# EAGLE design controller4 (EAGLE 9.6.2)
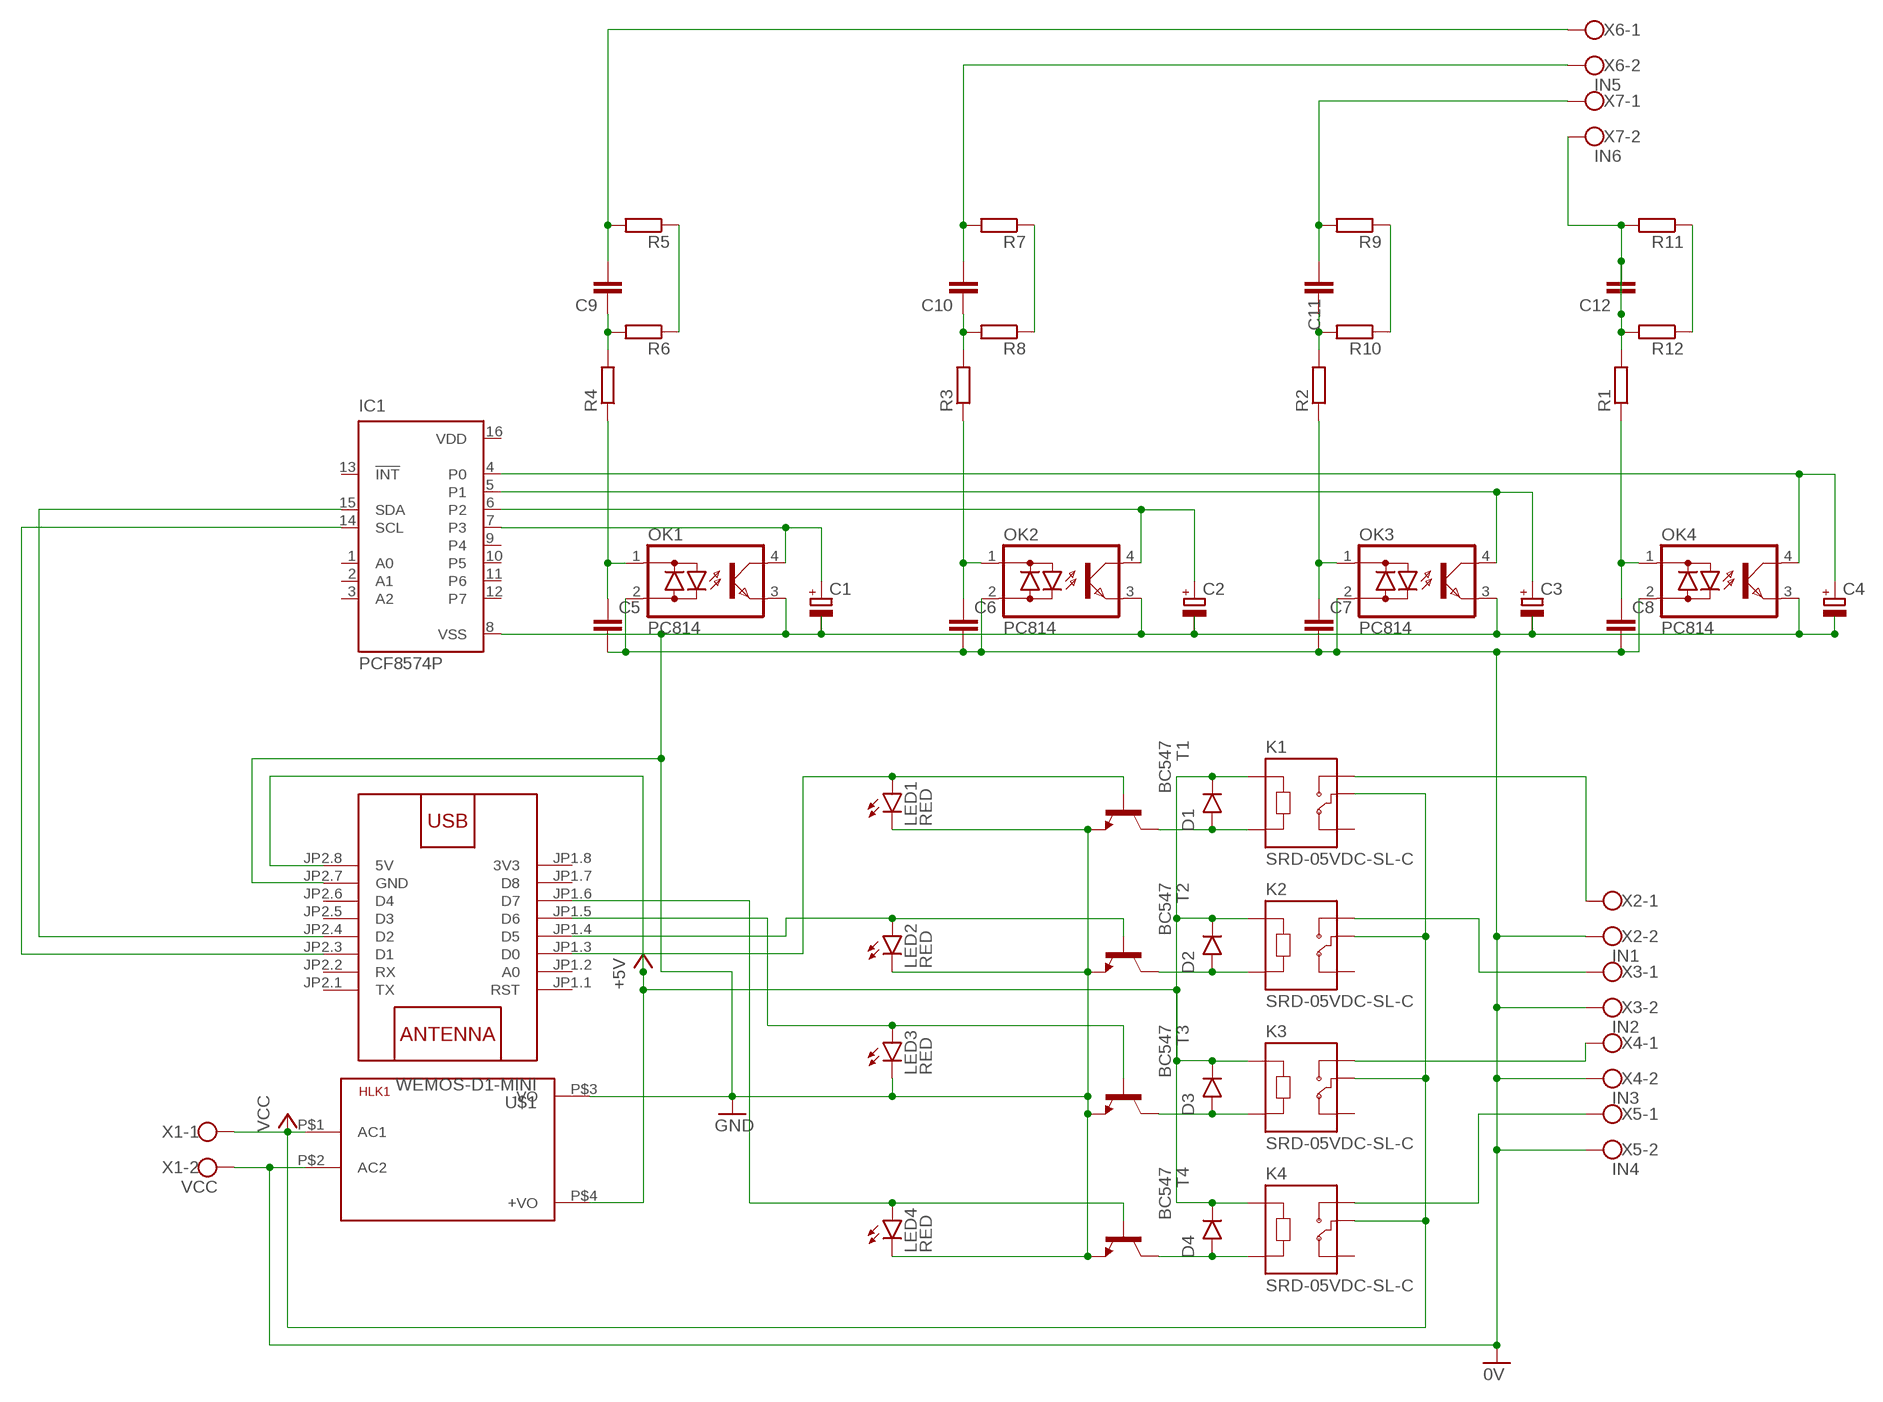
[diagram p0: schematic, sheet 1]

## Parts
C1  CPOL-EUE5-5  [E5-5]
C2  CPOL-EUE5-5  [E5-5]
C3  CPOL-EUE5-5  [E5-5]
C4  CPOL-EUE5-5  [E5-5]
C5  C-EU025-024X044  [C025-024X044]
C6  C-EU025-024X044  [C025-024X044]
C7  C-EU025-024X044  [C025-024X044]
C8  C-EU025-024X044  [C025-024X044]
C9  C-EU025-024X044  [C025-024X044]
C10  C-EU025-024X044  [C025-024X044]
C11  C-EU025-024X044  [C025-024X044]
C12  C-EU025-024X044  [C025-024X044]
D1  1N4001  [DO41-10]
D2  1N4001  [DO41-10]
D3  1N4001  [DO41-10]
D4  1N4001  [DO41-10]
HLK1  HLK-PM013W  [HLK-PM01]
IC1  PCF8574P  [DIL16]
K1  SRD-05VDC-SL-C  [RELAY_SRD-05VDC-SL-C]
K2  SRD-05VDC-SL-C  [RELAY_SRD-05VDC-SL-C]
K3  SRD-05VDC-SL-C  [RELAY_SRD-05VDC-SL-C]
K4  SRD-05VDC-SL-C  [RELAY_SRD-05VDC-SL-C]
LED1  RED  LED3MM  [LED3MM]
LED2  RED  LED3MM  [LED3MM]
LED3  RED  LED3MM  [LED3MM]
LED4  RED  LED3MM  [LED3MM]
OK1  PC814  [DIL04]
OK2  PC814  [DIL04]
OK3  PC814  [DIL04]
OK4  PC814  [DIL04]
R1  R-EU_0204/5  [0204/5]
R2  R-EU_0204/5  [0204/5]
R3  R-EU_0204/5  [0204/5]
R4  R-EU_0204/5  [0204/5]
R5  R-EU_0204/5  [0204/5]
R6  R-EU_0204/5  [0204/5]
R7  R-EU_0204/5  [0204/5]
R8  R-EU_0204/5  [0204/5]
R9  R-EU_0204/5  [0204/5]
R10  R-EU_0204/5  [0204/5]
R11  R-EU_0204/5  [0204/5]
R12  R-EU_0204/5  [0204/5]
T1  BC547  [TO92]
T2  BC547  [TO92]
T3  BC547  [TO92]
T4  BC547  [TO92]
U$1  WEMOS-D1-MINI  [WEMOS-D1-MINI]
X1  VCC  W237-102  [W237-102]
X2  IN1  W237-102  [W237-102]
X3  IN2  W237-102  [W237-102]
X4  IN3  W237-102  [W237-102]
X5  IN4  W237-102  [W237-102]
X6  IN5  W237-102  [W237-102]
X7  IN6  W237-102  [W237-102]

## Nets
0V: C5.2 C6.2 C7.2 C8.2 HLK1.P$2(AC2) OK1.2(AC2) OK2.2(AC2) OK3.2(AC2) OK4.2(AC2) X1.2 X2.2 X3.2 X4.2 X5.2
+5V: D1.C(CATHODE) D2.C(CATHODE) D3.C(CATHODE) D4.C(CATHODE) HLK1.P$4(+VO) K1.A1 K2.A1 K3.A1 K4.A1 U$1.JP2.8(5V)
GND: C1.- C2.- C3.- C4.- HLK1.P$3(-VO) IC1.8(VSS) LED1.K(C) LED2.K(C) LED3.K(C) LED4.K(C) OK1.3(E) OK2.3(E) OK3.3(E) OK4.3(E) T1.1(E) T2.1(E) T3.1(E) T4.1(E) U$1.JP2.7(GND)
N$1: D1.A(ANODE) K1.A2 T1.3(C)
N$2: K1.NO X2.1
N$3: D2.A(ANODE) K2.A2 T2.3(C)
N$4: D3.A(ANODE) K3.A2 T3.3(C)
N$5: D4.A(ANODE) K4.A2 T4.3(C)
N$6: C1.+ IC1.7(P3) OK1.4(C)
N$7: C2.+ IC1.6(P2) OK2.4(C)
N$8: C3.+ IC1.5(P1) OK3.4(C)
N$9: C4.+ IC1.4(P0) OK4.4(C)
N$10: C9.1 R4.2 R6.2
N$11: K2.NO X3.1
N$12: K3.NO X4.1
N$13: K4.NO X5.1
N$14: LED2.A T2.2(B) U$1.JP1.4(D5)
N$15: LED1.A T1.2(B) U$1.JP1.3(D0)
N$16: LED4.A T4.2(B) U$1.JP1.6(D7)
N$17: IC1.14(SCL) U$1.JP2.3(D1)
N$18: IC1.15(SDA) U$1.JP2.4(D2)
N$19: LED3.A T3.2(B) U$1.JP1.5(D6)
N$20: C10.1 R3.2 R8.2
N$21: C11.1 R2.2 R10.2
N$22: C8.1 OK4.1(AC1) R1.1
N$23: C11.2 R9.2 X7.1
N$24: C10.2 R7.2 X6.2
N$25: C9.2 R5.2 X6.1
N$26: R5.1 R6.1
N$27: C12.1 C12.2 R1.2 R11.2 R12.2 X7.2
N$28: C7.1 OK3.1(AC1) R2.1
N$29: C6.1 OK2.1(AC1) R3.1
N$30: C5.1 OK1.1(AC1) R4.1
N$31: R7.1 R8.1
N$32: R9.1 R10.1
N$33: R11.1 R12.1
VCC: HLK1.P$1(AC1) K1.COM K2.COM K3.COM K4.COM X1.1
Unconnected: IC1.1(A0) IC1.2(A1) IC1.3(A2) IC1.9(P4) IC1.10(P5) IC1.11(P6) IC1.12(P7) IC1.13(!INT) K1.NC K2.NC K3.NC K4.NC U$1.JP1.1(RST) U$1.JP1.2(A0) U$1.JP1.7(D8) U$1.JP2.1(TX) U$1.JP2.2(RX) U$1.JP2.5(D3) U$1.JP2.6(D4)

## Power pins joined to a net without a drawn wire
3V3: U$1.JP1.8(3V3)
VDD: IC1.16(VDD)

## Library data of the parts
C1-C4 = rcl:CPOL-EU: POLARIZED CAPACITOR, European symbol; SPICEPREFIX: C
C5-C12 = rcl:C-EU: CAPACITOR, European symbol; SPICEPREFIX: C
D1-D4 = tango:1N4001: DIODE general purpose rectifier, 1 A
HLK1 = HLK-PM01:HLK-PM01: Hi-Link Power Supply HLK-PM01 3W Author: Ahmed Said <https://github.com/AhmedSaid/EAGLELibraries>
IC1 = micro-philips:PCF8574: I2C-Bus Remote 8-bit I/O expander http://www.semiconductors.philips.com/acrobat_download/datasheets/PCF8574_4.pdf; MPN: PCF8574PN; OC_FARNELL: 204020; OC_NEWARK: 11N8515
K1-K4 = SRD-05VDC-SL-C (1):SRD-05VDC-SL-C: 5V Trigger Relay Module For Arduino And Raspberry Pi 5V Trigger Relay Module For Arduino And Raspberry Pi; AVAILABILITY: Unavailable; DESCRIPTION: 5V Trigger Relay Module For Arduino And Raspberry Pi 5V Trigger Relay Module For Arduino And Raspberry Pi; MF: Songle Relay; MP: SRD-05VDC-SL-C; PACKAGE: None; PRICE: None
LED1-LED4 = led:LED: LED OSRAM: - CHIPLED LG R971, LG N971, LY N971, LG Q971, LY Q971, LO R971, LY R971 LH N974, LH R974 LS Q976, LO Q976, LY Q976 LO Q996 - Hyper CHIPLED LW Q18S LB Q993, LB Q99A, LB R99A - SideLED LS A670, LO A670, LY A670, LG A670, LP A670 LB A673, LV A673, LT A673, LW A673 LH A674 LY A675 LS A676, LA A676, LO A676, LY A676, LW A676 LS A679, LY A679, LG A679 - Hyper Micro SIDELED® LS Y876, LA Y876, LO Y876, LY Y876 LT Y87S - SmartLED LW L88C, LW L88S LB L89C, LB L89S, LG L890 LS L89K, LO L89K, LY L89K LS L896, LA L896, LO L896, LY L896 - TOPLED LS T670, LO T670, LY T670, LG T670, LP T670 LSG T670, LSP T670, LSY T670, LOP T670, LYG T670 LG T671, LOG T671, LSG T671 LB T673, LV T673, LT T673, LW T673 LH T674 LS T676, LA T676, LO T676, LY T676, LB T676, LH T676, LSB T676, LW T676 LB T67C, LV T67C, LT T67C, LS T67K, LO T67K, LY T67K, LW E67C LS E67B, LA E67B, LO E67B, LY E67B, LB E67C, LV E67C, LT E67C LW T67C LS T679, LY T679, LG T679 LS T770, LO T770, LY T770, LG T770, LP T770 LB T773, LV T773, LT T773, LW T773 LH T774 LS E675, LA E675, LY E675, LS T675 LS T776, LA T776, LO T776, LY T776, LB T776 LHGB T686 LT T68C, LB T68C - Hyper Mini TOPLED® LB M676 - Mini TOPLED Santana® LG M470 LS M47K, LO M47K, LY M47K Source: http://www.osram.convergy.de LUXEON: - LUMILED® LXK2-PW12-R00, LXK2-PW12-S00, LXK2-PW14-U00, LXK2-PW14-V00 LXK2-PM12-R00, LXK2-PM12-S00, LXK2-PM14-U00 LXK2-PE12-Q00, LXK2-PE12-R00, LXK2-PE12-S00, LXK2-PE14-T00, LXK2-PE14-U00 LXK2-PB12-K00, LXK2-PB12-L00, LXK2-PB12-M00, LXK2-PB14-N00, LXK2-PB14-P00, LXK2-PB14-Q00 LXK2-PR12-L00, LXK2-PR12-M00, LXK2-PR14-Q00, LXK2-PR14-R00 LXK2-PD12-Q00, LXK2-PD12-R00, LXK2-PD12-S00 LXK2-PH12-R00, LXK2-PH12-S00 LXK2-PL12-P00, LXK2-PL12-Q00, LXK2-PL12-R00 Source: www.luxeon.com KINGBRIGHT: KA-3528ASYC Source: www.kingbright.com
OK1-OK4 = optocoupler:PC814: SHARP OPTO COUPLER; OC_FARNELL: 9707662; OC_NEWARK: unknown
R1-R12 = rcl:R-EU_: RESISTOR, European symbol; SPICEPREFIX: R
T1-T4 = transistor:BC547: NPN TRANSISTOR
U$1 = diy-modules:WEMOS-D1-MINI: WEMOS D1 mini: Mini Wi-Fi Board based on ESP-8266 device More details can be found here: https://www.wemos.cc/product/d1-mini.html Click here to find device on ebay.com <http://www.ebay.com/sch/wemos+d1+mini+nodemcu>
X1-X7 = con-wago-500:W237-102: WAGO SCREW CLAMP; MPN: 237-102; OC_FARNELL: unknown; OC_NEWARK: 70K9898

## Board
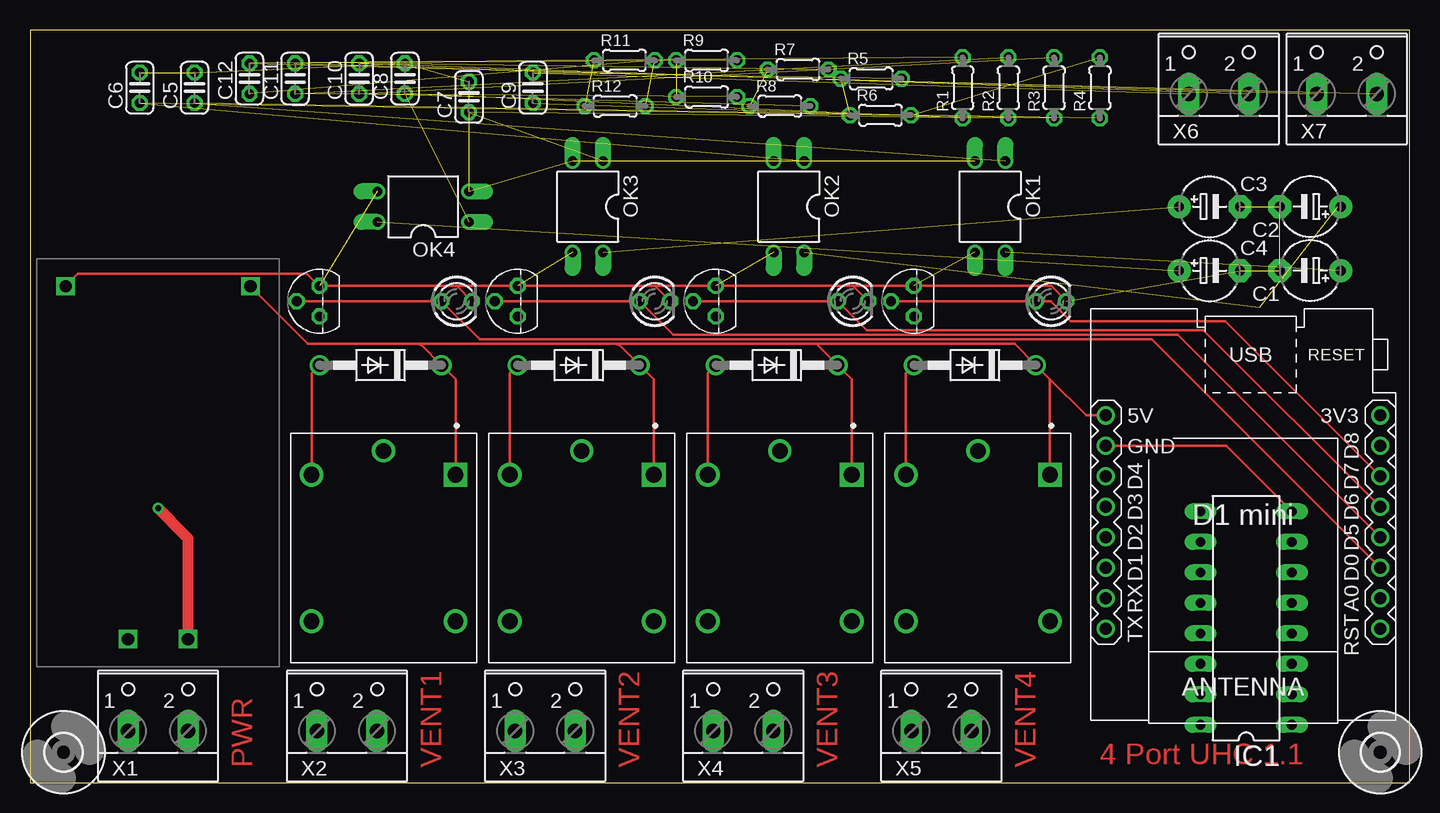
[diagram p1: board, top side]
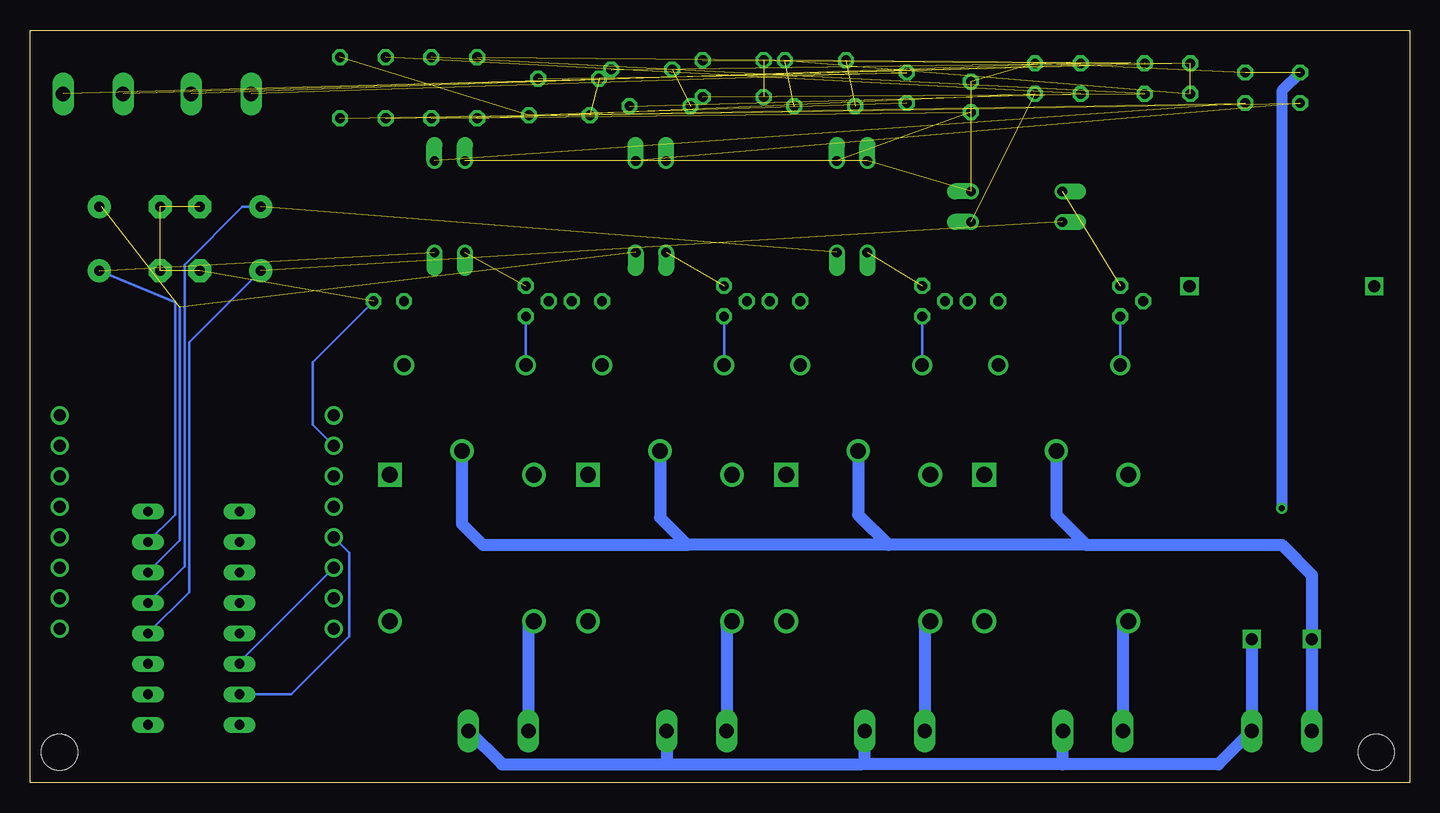
[diagram p2: board, bottom side, seen from below]

Size 114.99 x 62.73 mm. Coordinates in mm from the lower left corner, seen from the top.
Outline: 0,0 114.99,0 114.99,62.73 0,62.73 0,0
Copper layers (1*16): Top 0.035mm / dielectric 1.5mm / Bottom 0.035mm
Design rules "default": minimum track width 6mil, minimum drill 0.35mm, track to track 6mil, track to pad 6mil, pad to pad 6mil, via to via 6mil, smd to smd 6mil, copper to edge 40mil, drill to drill 6mil, minimum pad ring 10mil, minimum via ring 8mil, stop-mask expansion 4mil, vias tented up to drill 0mil, thermal gap 10mil

### Footprints (pad centres in the part's own frame; a part is rotated, then mirrored left to right if it is on the bottom)
E5-5 = drill 0.813 pad 1.905: + -2.54,0 | drill 0.813 pad 1.905 octagon: - 2.54,0
C025-024X044 = drill 0.813 octagon: 1 -1.27,0; 2 1.27,0
DO41-10 = drill 1.118: A 5.08,0; C -5.08,0
HLK-PM01 = drill 1.016 square: P$1 -14.7,2.5; P$2 -14.7,-2.5; P$3 14.7,7.7; P$4 14.7,-7.7
DIL16 = drill 0.813 long: 1 -8.89,-3.81; 2 -6.35,-3.81; 3 -3.81,-3.81; 4 -1.27,-3.81; 5 1.27,-3.81; 6 3.81,-3.81; 7 6.35,-3.81; 8 8.89,-3.81; 9 8.89,3.81; 10 6.35,3.81; 11 3.81,3.81; 12 1.27,3.81; 13 -1.27,3.81; 14 -3.81,3.81; 15 -6.35,3.81; 16 -8.89,3.81
RELAY_SRD-05VDC-SL-C = drill 1.32 square: A1 -6.1,6 | drill 1.32: A2 -6.1,-6; NC 6.1,6; NO 6.1,-6 | drill 1.29: COM -8.1,0
LED3MM = drill 0.813 octagon: A -1.27,0; K 1.27,0
DIL04 = drill 0.813 offset: 1 -1.27,-3.81; 2 1.27,-3.81; 3 1.27,3.81; 4 -1.27,3.81
0204/5 = drill 0.813 octagon: 1 -2.54,0; 2 2.54,0
TO92 = drill 0.813 octagon: 1 1.27,0; 2 0,1.905; 3 -1.27,0
WEMOS-D1-MINI = drill 1: JP1.1 -11.43,9.525; JP1.2 -11.43,6.985; JP1.3 -11.43,4.445; JP1.4 -11.43,1.905; JP1.5 -11.43,-0.635; JP1.6 -11.43,-3.175; JP1.7 -11.43,-5.715; JP1.8 -11.43,-8.255; JP2.1 11.43,9.525; JP2.2 11.43,6.985; JP2.3 11.43,4.445; JP2.4 11.43,1.905; JP2.5 11.43,-0.635; JP2.6 11.43,-3.175; JP2.7 11.43,-5.715; JP2.8 11.43,-8.255
3,0 = hole 3: 0,0
W237-102 = drill 1.194 long: 1 -2.5,-1.27; 2 2.5,-1.27

### Placement (x,y rotation side)
C1  106.68,42.67 180 top
C2  106.68,48.01 180 top
C3  98.3,48.01 0 top
C4  98.3,42.67 0 top
C5  13.72,57.91 90 top
C6  9.14,57.91 90 top
C7  36.58,57.15 90 top
C8  31.24,58.67 90 top
C9  41.91,57.91 90 top
C10  27.43,58.67 90 top
C11  22.1,58.67 90 top
C12  18.29,58.67 90 top
D1  29.21,34.8 180 top
D2  45.72,34.8 180 top
D3  62.23,34.8 180 top
D4  78.74,34.8 180 top
HLK1  10.67,26.67 90 top
IC1  101.35,13.72 90 top
K1  29.46,19.56 270 top
K2  45.97,19.56 270 top
K3  62.48,19.56 270 top
K4  78.99,19.56 270 top
LED1  35.56,40.13 0 top
LED2  52.07,40.13 0 top
LED3  68.58,40.13 0 top
LED4  85.09,40.13 0 top
OK1  80.01,48.01 180 top
OK2  63.25,48.01 180 top
OK3  46.48,48.01 180 top
OK4  32.77,48.01 90 top
R1  77.72,57.91 90 top
R2  81.53,57.91 90 top
R3  85.34,57.91 90 top
R4  89.15,57.91 90 top
R5  70.1,58.67 0 top
R6  70.87,55.63 0 top
R7  64.01,59.44 0 top
R8  62.48,56.39 0 top
R9  56.39,60.2 0 top
R10  56.39,57.15 0 top
R11  49.53,60.2 0 top
R12  48.77,56.39 0 top
T1  24.13,40.13 90 top
T2  40.64,40.13 90 top
T3  57.15,40.13 90 top
T4  73.66,40.13 90 top
U$1  101.09,22.35 180 top
U$2  [3,0]  112.52,2.54 0 top
U$3  [3,0]  2.79,2.54 0 top
X1  10.67,5.59 0 top
X2  26.42,5.59 0 top
X3  42.93,5.59 0 top
X4  59.44,5.59 0 top
X5  75.95,5.59 0 top
X6  99.06,58.67 0 top
X7  109.73,58.67 0 top

### Tracks (layer width: path | path; a pad name or v marks a point on that pad's centre or on a via)
0V  (via drill 0.5)  (7 unrouted)
  Top 0.914: HLK1.P$2 13.17,20.35 12.95,20.57 v10.67,22.86
  Bottom 0.914: C6.2 10.67,57.66 v10.67,22.86
  Bottom 1.016: HLK1.P$2 X1.2 15.96,1.52 28.96,1.52 | X5.2 75.65,1.52 61.72,1.52 | 28.96,1.52 45.72,1.52 | 61.72,1.52 45.72,1.52 | 28.96,1.52 28.92,1.56 X2.2 | 45.72,1.52 45.43,1.82 X3.2 | X4.2 61.94,1.74 61.72,1.52
+5V
  Top 0.229: HLK1.P$4 23.16,36.58 32.29,36.58 | 32.29,36.58 32.64,36.45 D1.C 35.46,33.62 K1.A1 | 32.29,36.58 48.8,36.58 | 48.8,36.58 65.53,36.58 | 65.53,36.58 82.04,36.58 D4.C 84.99,33.62 | 65.53,36.58 D3.C 68.48,33.62 K3.A1 | 48.8,36.58 49.15,36.45 D2.C 51.97,33.62 K2.A1 | K4.A1 84.99,33.62 | 84.99,33.62 88.01,30.61 U$1.JP2.8
GND  (8 unrouted)
  Top 0.229: HLK1.P$3 4,42.4 23.05,42.4 24.05,41.4 T1.1 35.56,41.4 | 35.56,41.4 T2.1 52.07,41.4 | 52.07,41.4 T3.1 | T3.1 57.16,41.39 | T3.1 68.58,41.4 | 68.58,41.4 T4.1 85.09,41.4 LED4.K | LED1.K 35.56,41.4 | LED2.K 52.07,41.4 | LED3.K 68.58,41.4 | U$1.JP2.7 99.69,28.07 IC1.8
  Bottom 0.229: LED4.K 91.44,35.05 91.44,29.84 U$1.JP2.7
N$1
  Top 0.229: 23.37,25.75 K1.A2 23.46,34.13 D1.A
  Bottom 0.229: T1.3 D1.A
N$2
  Bottom 1.016: K1.NO 23.92,13.01 X2.1
N$3
  Top 0.229: K2.A2 39.97,34.13 D2.A
  Bottom 0.229: T2.3 D2.A
N$4
  Top 0.229: K3.A2 56.48,34.13 D3.A
  Bottom 0.229: T3.3 D3.A
N$5
  Top 0.229: 72.9,25.75 K4.A2 72.99,34.13 D4.A
  Bottom 0.229: T4.3 D4.A
N$6  (1 unrouted)
  Bottom 0.229: IC1.7 102.87,22.35 102.87,40.06 C1.+
N$7  (2 unrouted)
  Bottom 0.229: IC1.6 102.49,20.19 102.49,39.62 | 109,48.01 C2.+
N$8  (1 unrouted)
  Bottom 0.229: IC1.5 102.11,18.03 102.11,43.18 97.28,48.01 C3.+
N$9  (1 unrouted)
  Bottom 0.229: IC1.4 101.73,15.88 101.73,36.7 C4.+
N$10  (2 unrouted)
N$11
  Bottom 1.016: K2.NO 40.43,13.01 X3.1
N$12
  Bottom 1.016: K3.NO 56.94,13.01 X4.1
N$13
  Bottom 1.016: K4.NO 73.45,13.01 X5.1
N$14
  Top 0.229: T2.2 LED2.A 53.59,37.34 95.63,37.34 U$1.JP1.4
N$15
  Top 0.229: T1.2 LED1.A 37.47,36.96 93.47,36.96 U$1.JP1.3
N$16
  Top 0.229: T4.2 LED4.A | LED4.A 84.39,40.13 | LED4.A 85.05,40.13 86.74,38.44 99.61,38.44 U$1.JP1.6
N$17
  Bottom 0.229: U$1.JP2.3 97.54,10.03 IC1.14
N$18
  Bottom 0.229: U$1.JP2.4 88.39,19.18 88.39,12.19 93.22,7.37 IC1.15
N$19
  Top 0.229: T3.2 LED3.A 69.72,37.72 97.54,37.72 97.79,37.72 U$1.JP1.5
N$20  (2 unrouted)
N$21  (2 unrouted)
N$22  (2 unrouted)
N$23  (2 unrouted)
N$24  (2 unrouted)
N$25  (2 unrouted)
N$26  (1 unrouted)
N$27  (5 unrouted)
N$28  (2 unrouted)
N$29  (2 unrouted)
N$30  (2 unrouted)
N$31  (1 unrouted)
N$32  (1 unrouted)
N$33  (1 unrouted)
VCC
  Bottom 1.016: X1.1 HLK1.P$1 8.17,17.3 10.68,19.81 26.95,19.81 | K4.COM 78.99,21.56 77.24,19.81 60.2,19.81 | K3.COM 62.48,22.1 60.2,19.81 | K2.COM 45.97,22.35 43.43,19.81 | 26.95,19.81 43.43,19.81 | K1.COM 29.46,22.32 26.95,19.81 | 43.43,19.81 60.2,19.81

### Text on the board
Top: 4 Port UHC 1.1 | PWR | VENT1 | VENT2 | VENT3 | VENT4